# Altium schematic sheet CW308_Clock.SchDoc: Crystal Oscillator
size Letter; ApprovedBy: N; Organization: NewAE Technology Inc.; Address1: 1083 Queen St., Suite 196; Address2: Halifax; Address3: NS; Address4: Canada B3H 0B2; DocumentNumber: 4; SheetNumber: 4; SheetTotal: 5; SheetApproved: YES
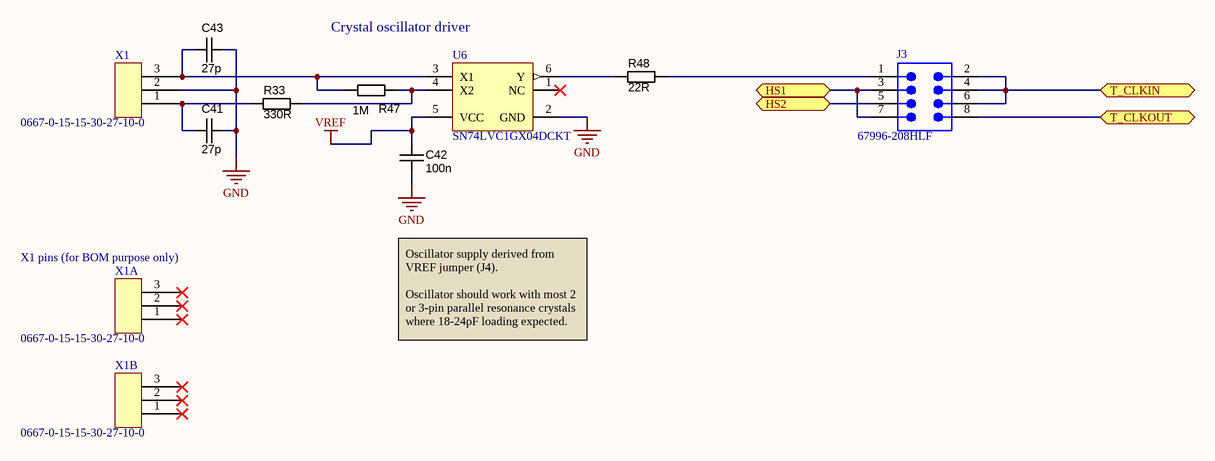
[diagram p0: CW308_Clock.SchDoc]

## Parts
C41  27p  [CAPC1608X90N]
C42  value 100n  [CAPC1608X90N]  (hidden comment: approved sub OK)
C43  27p  [CAPC1608X90N]
J3  67996-208HLF  [SMTC-MTSW-104-12-X-D-006]
R33  value 330R  [RESC1608X55N]  (hidden comment: Thick Film)
R47  value 1M  [RESC1608X55N]  (hidden comment: Thick Film)
R48  value 22R  [RESC1608X55N]  (hidden comment: Thick Film)
U6  SN74LVC1GX04DCKT  [DCK0006A_L]
X1  0667-0-15-15-30-27-10-0  [HC49U_SOCKET]
X1A  0667-0-15-15-30-27-10-0  [HC49U_SOCKET]  (mechanical)
X1B  0667-0-15-15-30-27-10-0  [HC49U_SOCKET]  (mechanical)

## Ports
HS1 (bidir), HS2 (bidir), T_CLKIN (bidir), T_CLKOUT (bidir)

## Nets
GND: C41.2 C42.2 C43.2 U6.2(GND) X1.2
VREF: C42.1 U6.5(VCC)
HS1: J3.3 J3.7 ; port HS1
HS2: J3.5 ; port HS2
T_CLKIN: J3.2 J3.4 J3.6 ; port T_CLKIN
T_CLKOUT: J3.8 ; port T_CLKOUT
NetC41_1: C41.1 R33.1 X1.1
NetC43_1: C43.1 R47.1 U6.3(X1) X1.3
NetJ3_1: J3.1 R48.2
NetR33_2: R33.2 R47.2 U6.4(X2)
NetR48_1: R48.1 U6.6(Y)

Not connected (* = marked no-connect by the designer): U6 1(NC)*; X1A 1* 2* 3*; X1B 1* 2* 3*

## Notes on the sheet
- Crystal oscillator driver
- (near X1A) X1 pins (for BOM purpose only)
- Oscillator supply derived from VREF jumper (J4).
  Oscillator should work with most 2 or 3-pin parallel resonance crystals where 18-24pF loading expected.
- Title:
- Date:
- Rev:
- Time:
- Project:
- Sheet
- of
- License:
- Copyright © NewAE Technology Inc.
- Approved:
- NewAE.com
- File:

## Library data of the parts
C41 C43 = CAPC_27p_0603_NP0_100V_1%: Capacitor SMD Cer 27pF 1% 100V NP0 0603; Manufacturer 1: AVX Corporation; Manufacturer Part Number 1: 06031A270FAT2A; Ratings: 100V; NP0; SCDType: undef; Tolerance: ±1%; Operating Temperature: -55°C ~ 125°C; Package / Case: 0603 (1608 Metric); Supplier 1: Digi-Key; Supplier Part Number 1: 478-3681-1-ND; Value: 27p
C42 = CAPC_100n_0603_X7R_50V_10%: Capacitor SMD Cer 100nF 10% 50V X7R 0603; Manufacturer 1: AVX Corporation; Manufacturer Part Number 1: 06035C104KAT2A; Ratings: 50V; X7R; Material: ceramic; SCDType: spec; Manufacturer 2: TDK Corporation; Manufacturer Part Number 2: C1608X7R1H104K; Package / Case: 0603 (1608 Metric); Tolerance: ±10%; Supplier 1: Digi-Key; Supplier Part Number 1: 478-5052-1-ND; ComponentLink1URL: http://www.avx.com/docs/Catalogs/cx7r.pdf; ComponentLink1Description: http://www.avx.com/docs/Catalogs/cx7r.pdf; Supplier 2: Digi-Key; Supplier Part Number 2: 445-1314-1-ND; ComponentLink2URL: http://product.tdk.com/capacitor/mlcc/en/documents/mlcc_commercial_general_en.pdf; ComponentLink2Description: http://product.tdk.com/capacitor/mlcc/en/documents/mlcc_commercial_general_en.pdf
J3 = CMP-1024-00110-1: Manufacturer: Amphenol FCI; Pitch: 2.54 mm; Temperature Range: -55 to 105 degC; Orientation: Vertical; PartNumber: 67996-208HLF; Mounting Technology: Through-hole; RoHS: True; Supplier 1: Digi-Key; Supplier Part Number 1: 609-3211-ND
R33 = RES_330R_0603_5%: Resistor SMD chip 330 Ohm 0.1W 5% 0603; Manufacturer 1: Vishay Dale; Manufacturer Part Number 1: CRCW0603330RJNEA; Ratings: 1/10 W; SCDType: spec; Manufacturer 2: Yageo; Manufacturer Part Number 2: RC0603JR-07330RL; Package / Case: 0603 (1608 metric); Tolerance: ±5%; Material: Thick Film; Supplier 1: Digi-Key; Supplier Part Number 1: 541-330GCT-ND; ComponentLink1URL: http://www.vishay.com/doc?20035; ComponentLink1Description: http://www.vishay.com/doc?20035; Supplier 2: Digi-Key; Supplier Part Number 2: 311-330GRCT-ND; ComponentLink2URL: http://www.yageo.com/documents/recent/PYu-RC0603_51_RoHS_L_4.pdf; ComponentLink2Description: http://www.yageo.com/documents/recent/PYu-RC0603_51_RoHS_L_4.pdf
R47 = RES_1M_0603_5%: Resistor SMD chip 1M Ohm 0.1W 5% 0603; Manufacturer 1: Vishay Dale; Manufacturer Part Number 1: CRCW06031M00JNEA; Ratings: 1/10 W; SCDType: spec; Package / Case: 0603 (1608 metric); Tolerance: ±5%; Material: Thick Film; Supplier 1: Digi-Key; Supplier Part Number 1: 541-1.0MGCT-ND; ComponentLink1URL: http://www.vishay.com/doc?20008; ComponentLink1Description: http://www.vishay.com/doc?20008; Supplier 2: Digi-Key; Supplier Part Number 2: 311-1.0MGRCT-ND; ComponentLink2URL: http://www.yageo.com/documents/recent/PYu-RC0603_51_RoHS_L_4.pdf; ComponentLink2Description: http://www.yageo.com/documents/recent/PYu-RC0603_51_RoHS_L_4.pdf; Manufacturer 2: Yageo; Manufacturer Part Number 2: RC0603JR-071ML
R48 = RES_22R_0603_5%: Resistor SMD chip 22 Ohm 0.1W 5% 0603; Manufacturer 1: Yageo; Manufacturer Part Number 1: RC0603JR-0722RL; Ratings: 1/10W; SCDType: spec; Temperature Coefficient: ±100ppm/°C; Tolerance: ±5%; Package / Case: 0603 (1608 metric); Case: 0603 (1608 metric); Supplier 1: Digi-Key; Supplier Part Number 1: 311-22GRCT-ND; RoHS 1: RoHS Compliant; ComponentLink1URL: http://www.yageo.com/documents/recent/PYu-RC0603_51_RoHS_L_4.pdf; ComponentLink1Description: http://www.yageo.com/documents/recent/PYu-RC0603_51_RoHS_L_4.pdf; Supplier 2: Digi-Key; Supplier Part Number 2: 1276-5022-6-ND; Manufacturer 2: Samsung Electro-Mechanics America, Inc; Manufacturer Part Number 2: RC1608J220CS; RoHS 2: RoHS Compliant; ComponentLink2URL: http://www.samsungsem.com/servlet/FileDownload?filename=productcatalog/pdf/Chip_Resistor.pdf; ComponentLink2Description: http://www.samsungsem.com/servlet/FileDownload?filename=productcatalog/pdf/Chip_Resistor.pdf; Supplier 3: Digi-Key; Supplier Part Number 3: RMCF0603JT22R0DKR-ND; Manufacturer 3: Stackpole Electronics Inc; Manufacturer Part Number 3: RMCF0603JT22R0; RoHS 3: RoHS Compliant; ComponentLink3URL: http://www.seielect.com/Catalog/SEI-RMCF_RMCP.pdf; ComponentLink3Description: http://www.seielect.com/Catalog/SEI-RMCF_RMCP.pdf; Supplier 4: Digi-Key; Supplier Part Number 4: RHM22CGDKR-ND; Manufacturer 4: Rohm Semiconductor; Manufacturer Part Number 4: MCR03ERTJ220; RoHS 4: RoHS Compliant; ComponentLink4URL: http://rohmfs.rohm.com/en/products/databook/datasheet/passive/resistor/chip_resistor/mcr_g.pdf; ComponentLink4Description: http://rohmfs.rohm.com/en/products/databook/datasheet/passive/resistor/chip_resistor/mcr_g.pdf; Supplier 5: Digi-Key; Supplier Part Number 5: P22GDKR-ND; Manufacturer 5: Panasonic Electronic Components; Manufacturer Part Number 5: ERJ-3GEYJ220V; RoHS 5: RoHS Compliant; ComponentLink5URL: http://industrial.panasonic.com/www-cgi/jvcr13pz.cgi?E+PZ+3+AOA0001+ERJ3GEYJ220V+7+WW; ComponentLink5Description: http://industrial.panasonic.com/www-cgi/jvcr13pz.cgi?E+PZ+3+AOA0001+ERJ3GEYJ220V+7+WW
U6 = CMP-0859-00485-3: Crystal Oscillator Driver, DCK0006A, SMALL T&R; Manufacturer: Texas Instruments; Sub-Family: Inverting Buffer/Driver; Voltage(Nom)(V): 1.8,2.5,3.3,5; tpd @ Nom Voltage(Max)(ns): 7,4,3.7,7; Bits(#): 1; Schmitt Trigger: No; Output Type: CMOS; Input Type: CMOS/TTL; Output Drive (IOL/IOH)(Max)(mA): 32/-32; Technology Family: LVC; F @ Nom Voltage(Max)(Mhz): 150; ICC @ Nom Voltage(Max)(mA): 0.01; Logic: True; VCC(Max)(V): 5.5; VCC(Min)(V): 1.65; Rating: Catalog; PackageReference: DCK0006A; Operating Temperature Range(C): -40 to 125; Generic Part Number: SN74LVC1GX04; DatasheetVersion: SCES581C; 3-State Output: No; Supplier 1: Digi-Key; Supplier Part Number 1: 296-32316-1-ND
X1 X1A X1B = XTALHOLDER_49US: XTAL Holder built using 3x 0667-0-15-15-30-27-10-0; Supplier 1: Digi-Key; Supplier Part Number 1: ED90102-ND; Manufacture Part Number 1: 3x 0667-0-15-15-30-27-10-0